# EAGLE design withcc3200 (EAGLE 6.5.0)

## Sheet 1 of 3
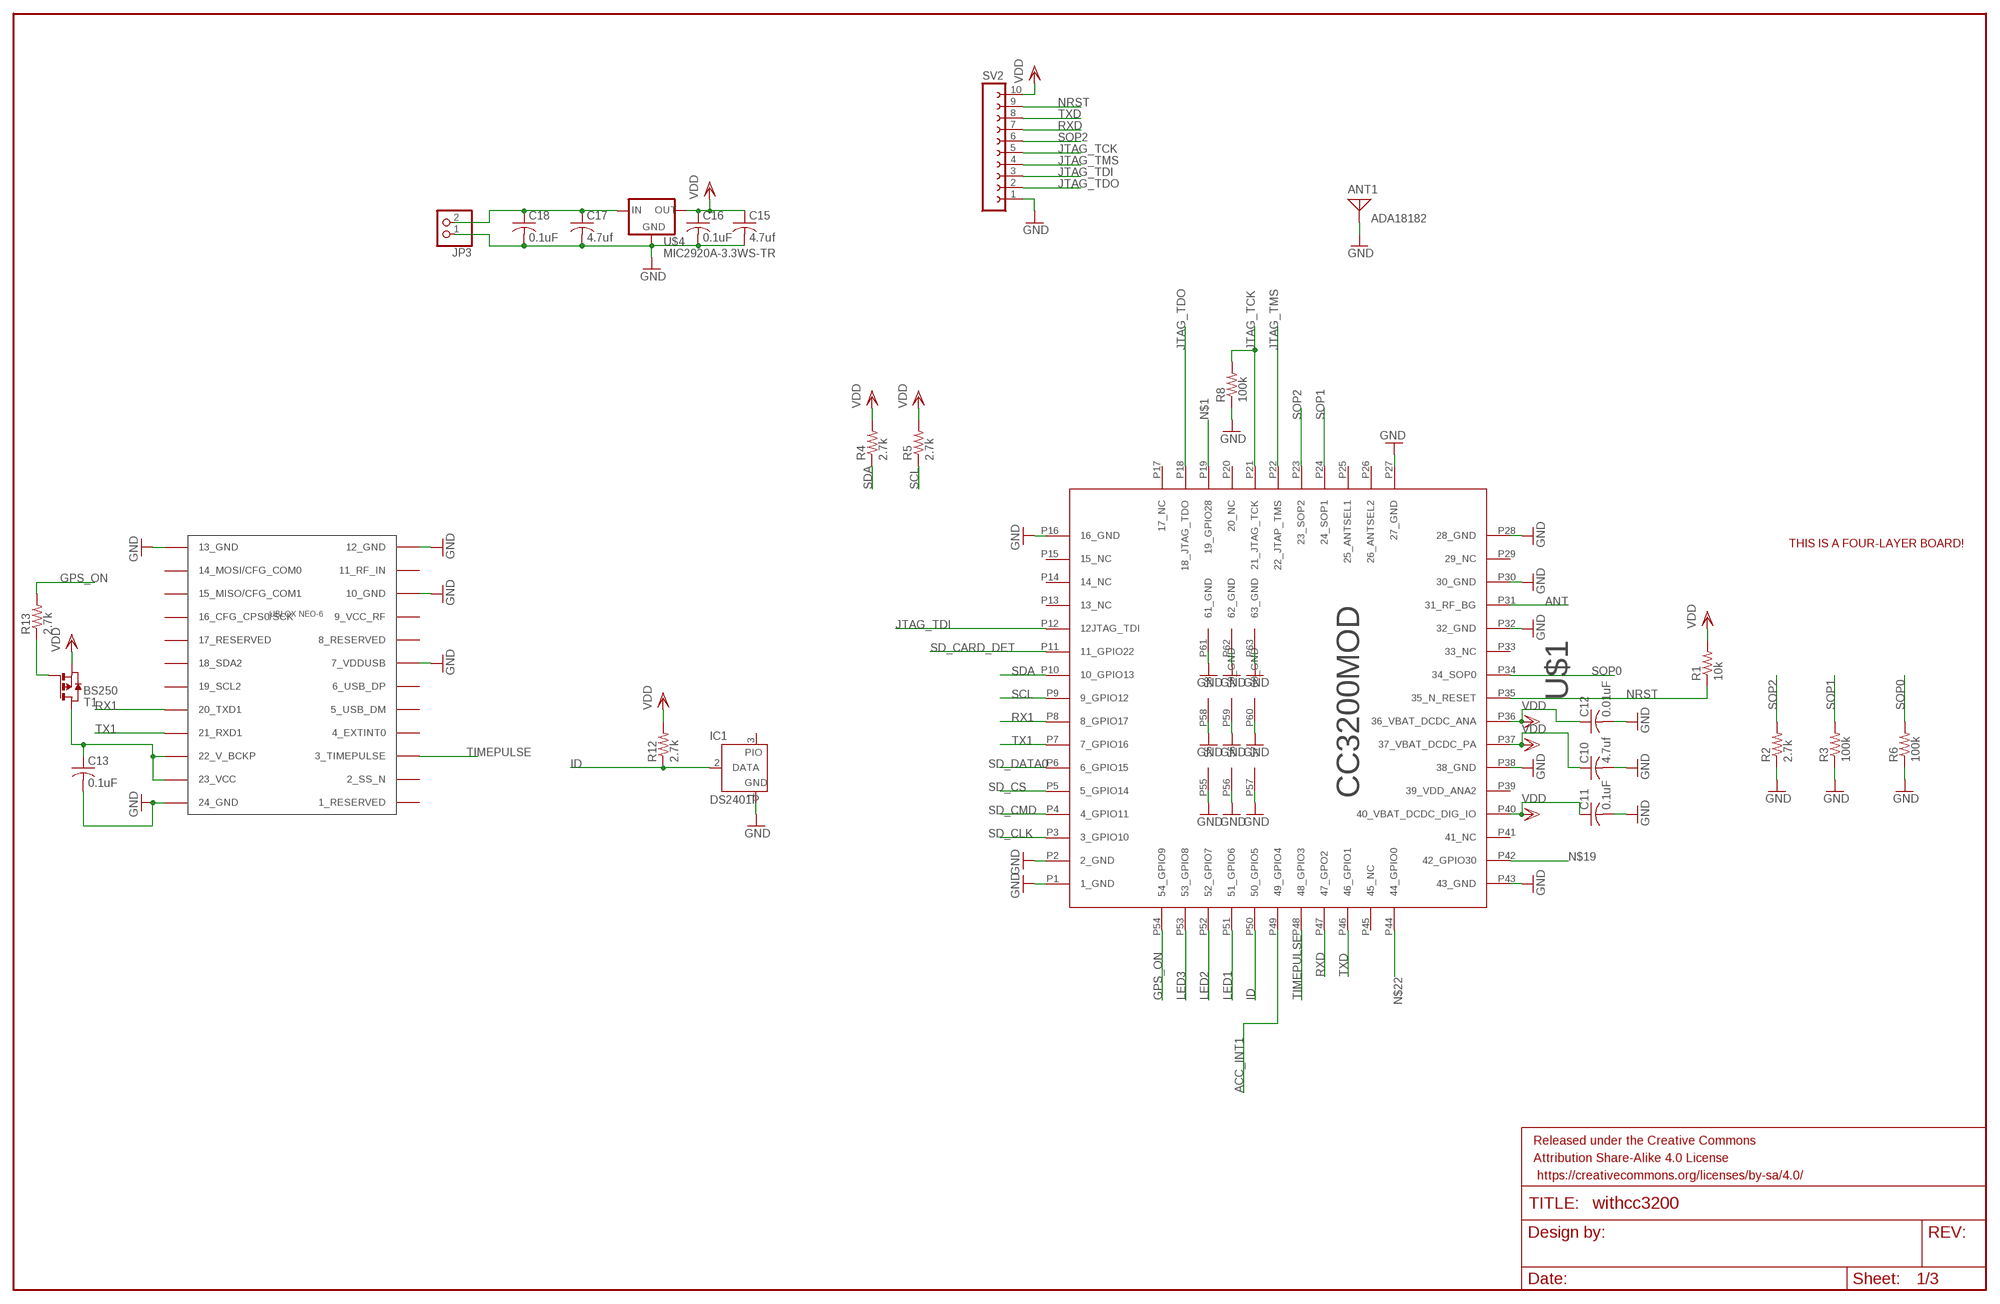
[diagram p0: schematic, sheet 1]

### Parts
ANT1  ADA18182  ANTENNA  [PAD-01]
C10  4.7uf  C-USC0805K  [C0805K]
C11  0.1uF  C-USC0805K  [C0805K]
C12  0.01uF  C-USC0805K  [C0805K]
C13  0.1uF  C-USC0805K  [C0805K]
C15  4.7uf  C-USC0805K  [C0805K]
C16  0.1uF  C-USC0805K  [C0805K]
C17  4.7uf  C-USC0805K  [C0805K]
C18  0.1uF  C-USC0805K  [C0805K]
FRAME1  FRAME-LEDGER  [CREATIVE_COMMONS]
IC1  DS2401P  DS2405P  [TSOC6]
JP3  PINHD-1X2  [1X02]
R1  10k  R-US_R0603  [R0603]
R2  2.7k  R-US_R0603  [R0603]
R3  100k  R-US_R0603  [R0603]
R4  2.7k  R-US_R0603  [R0603]
R5  2.7k  R-US_R0603  [R0603]
R6  100k  R-US_R0603  [R0603]
R8  100k  R-US_R0603  [R0603]
R12  2.7k  R-US_R0603  [R0603]
R13  2.7k  R-US_R0603  [R0603]
SV2  FE10-1  [FE10]
T1  BS250  PMOSSOT23  [SOT-23]
U$1  CC3200MOD  CC3200  [CC3200MOD]
U$2  UBLOX_NEO-7  UBLOX_NEO-6  [UBLOX_NEO-6P]
U$3  FOUR_LAYER_WARNING  [FOUR_LAYER_WARNING]
U$4  MIC2920A-3.3WS-TR  V_REG_MIC2920  [SOT223]

### Nets
ACC_INT1: U$1.P49(49_GPIO4) ; also sheet 2
ANT: U$1.P31(31_RF_BG)
GND: ANT1.1 C10.2 C11.2 C12.2 C13.2 C15.2 C16.2 C17.2 C18.2 IC1.1(GND) JP3.1 R2.1 R3.1 R6.1 R8.1 SV2.1 U$1.P1(1_GND) U$1.P2(2_GND) U$1.P16(16_GND) U$1.P27(27_GND) U$1.P28(28_GND) U$1.P30(30_GND) U$1.P32(32_GND) U$1.P38(38_GND) U$1.P43(43_GND) U$1.P55 U$1.P56 U$1.P57 U$1.P58 U$1.P59(59_GND) U$1.P60(60_GND) U$1.P61(61_GND) U$1.P62(62_GND) U$1.P63(63_GND) U$2.7_VDDUSB U$2.10_GND U$2.12_GND U$2.13_GND U$2.24_GND U$4.2(GND) ; also sheet 2,3
GPS_ON: R13.2 U$1.P54(54_GPIO9)
ID: IC1.2(DATA) R12.1 U$1.P50(50_GPIO5)
JTAG_TCK: R8.2 SV2.5 U$1.P21(21_JTAG_TCK)
JTAG_TDI: SV2.3 U$1.P12(12JTAG_TDI)
JTAG_TDO: SV2.2 U$1.P18(18_JTAG_TDO)
JTAG_TMS: SV2.4 U$1.P22(22_JTAP_TMS)
LED1: U$1.P51(51_GPIO6) ; also sheet 3
LED2: U$1.P52(52_GPIO7) ; also sheet 3
LED3: U$1.P53(53_GPIO8) ; also sheet 3
N$1: U$1.P19(19_GPIO28)
N$17: C17.1 C18.1 JP3.2 U$4.1(IN)
N$18: C13.1 T1.1(D) U$2.22_V_BCKP U$2.23_VCC
N$19: U$1.P42(42_GPIO30)
N$20: R13.1 T1.3(G)
N$22: U$1.P44(44_GPIO0)
NRST: R1.1 SV2.9 U$1.P35(35_N_RESET)
RX1: U$1.P8(8_GPIO17) U$2.20_TXD1
RXD: SV2.7 U$1.P47(47_GPO2)
SCL: R5.1 U$1.P9(9_GPIO12) ; also sheet 2
SD_CARD_DET: U$1.P11(11_GPIO22) ; also sheet 2
SD_CLK: U$1.P3(3_GPIO10) ; also sheet 2
SD_CMD: U$1.P4(4_GPIO11) ; also sheet 2
SD_CS: U$1.P5(5_GPIO14) ; also sheet 2
SD_DATA0: U$1.P6(6_GPIO15) ; also sheet 2
SDA: R4.1 U$1.P10(10_GPIO13) ; also sheet 2
SOP0: R6.2 U$1.P34(34_SOP0)
SOP1: R3.2 U$1.P24(24_SOP1)
SOP2: R2.2 SV2.6 U$1.P23(23_SOP2)
TIMEPULSE: U$1.P48(48_GPIO3) U$2.3_TIMEPULSE
TX1: U$1.P7(7_GPIO16) U$2.21_RXD1
TXD: SV2.8 U$1.P46(46_GPIO1)
VDD: C10.1 C11.1 C12.1 C15.1 C16.1 R1.2 R4.2 R5.2 R12.2 SV2.10 T1.2(S) U$1.P36(36_VBAT_DCDC_ANA) U$1.P37(37_VBAT_DCDC_PA) U$1.P40(40_VBAT_DCDC_DIG_IO) U$4.3(OUT) ; also sheet 2
Unconnected: IC1.3(PIO) U$1.P13(13_NC) U$1.P14(14_NC) U$1.P15(15_NC) U$1.P17(17_NC) U$1.P20(20_NC) U$1.P25(25_ANTSEL1) U$1.P26(26_ANTSEL2) U$1.P29(29_NC) U$1.P33(33_NC) U$1.P39(39_VDD_ANA2) U$1.P41(41_NC) U$1.P45(45_NC) U$2.1_RESERVED U$2.2_SS_N U$2.4_EXTINT0 U$2.5_USB_DM U$2.6_USB_DP U$2.8_RESERVED U$2.9_VCC_RF U$2.11_RF_IN U$2.14_MOSI/CFG_COM0 U$2.15_MISO/CFG_COM1 U$2.16_CFG_CPS0/SCK U$2.17_RESERVED U$2.18_SDA2 U$2.19_SCL2

## Sheet 2 of 3
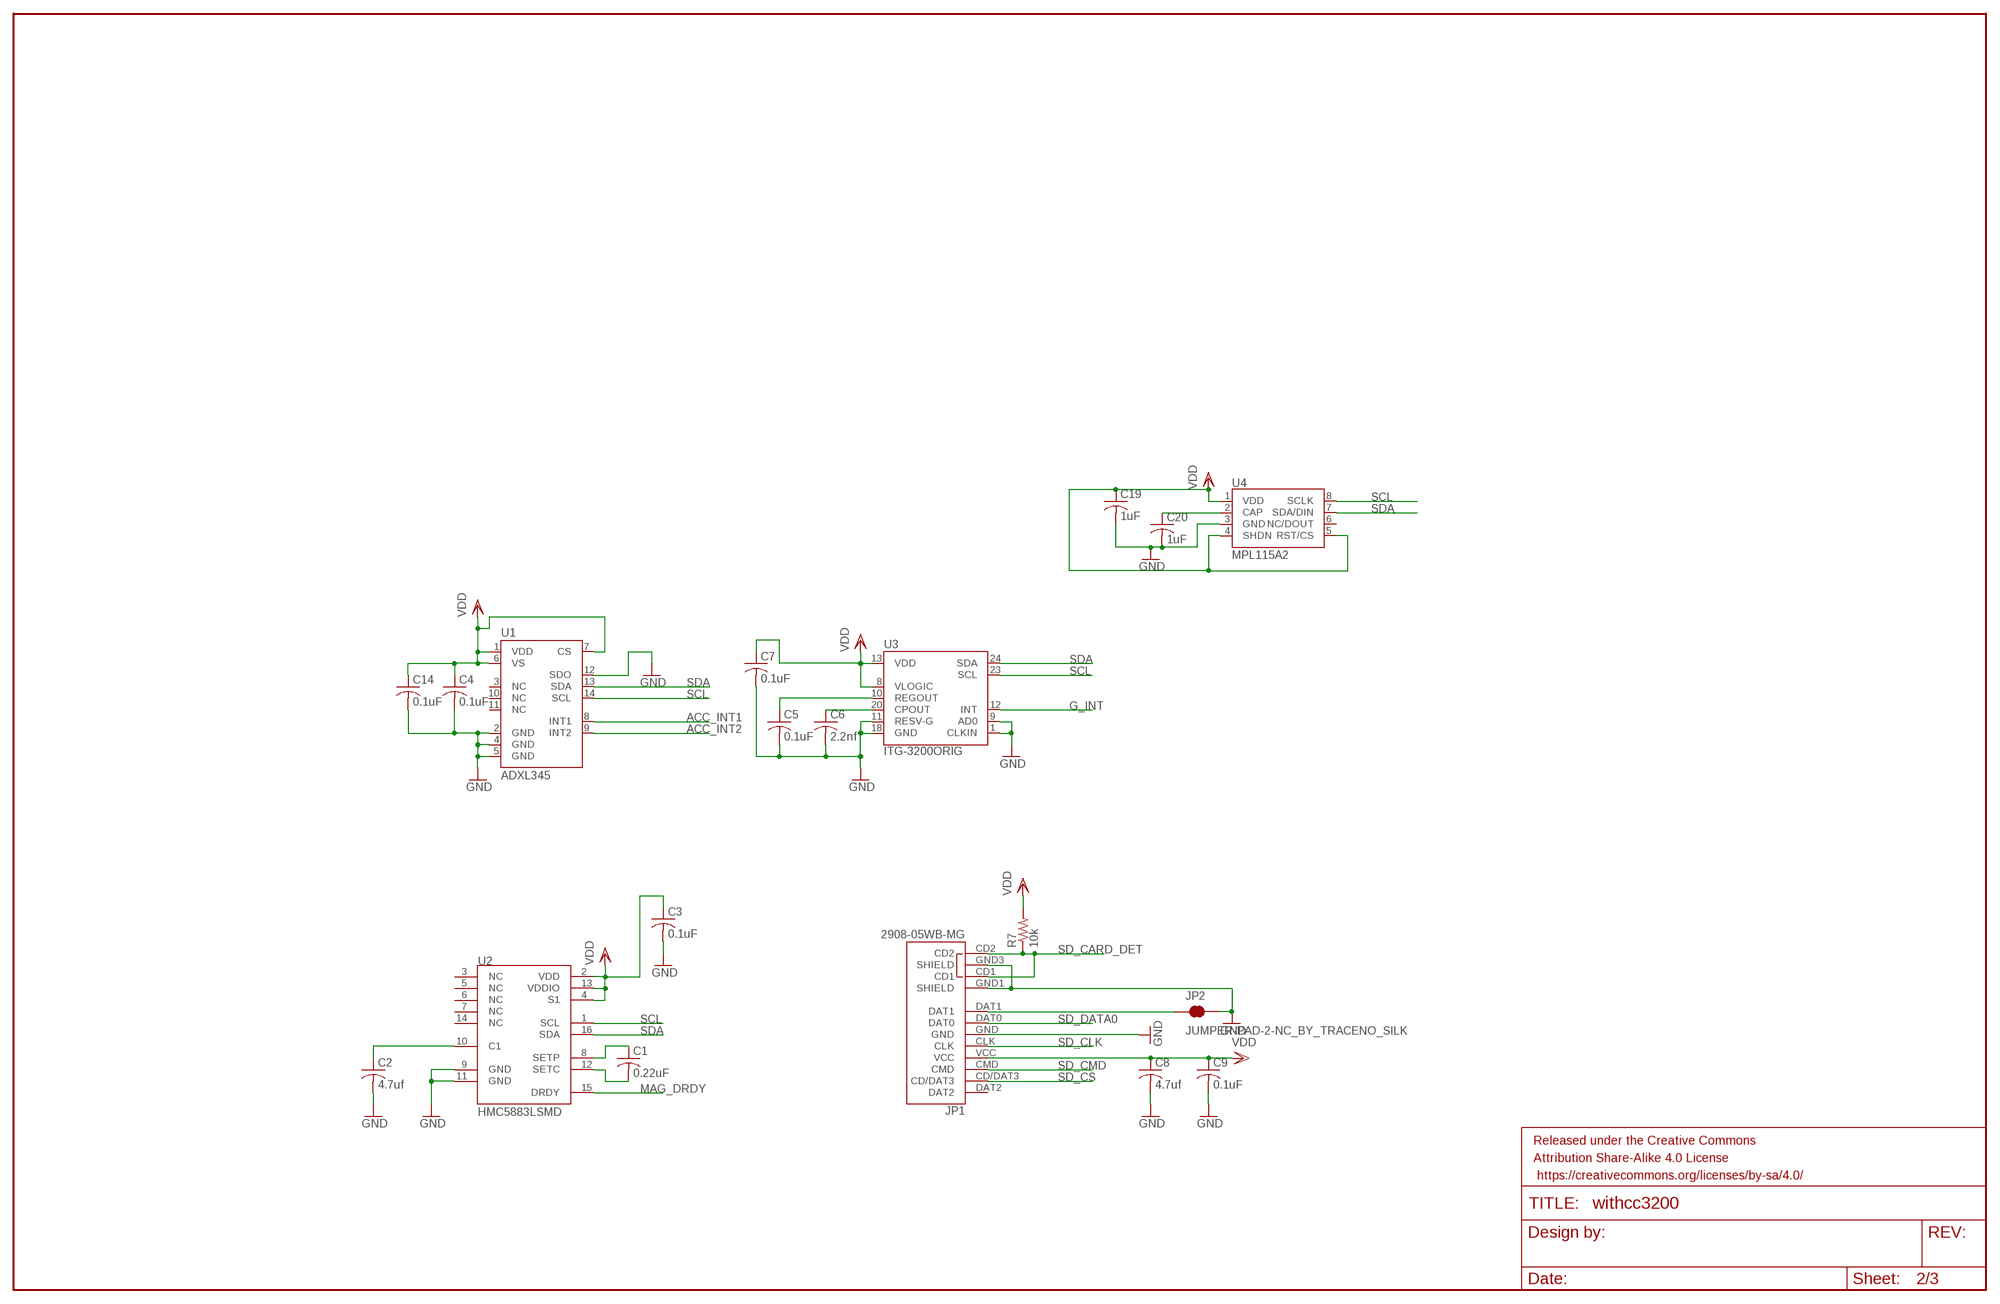
[diagram p1: schematic, sheet 2]

### Parts
C1  0.22uF  C-USC0805K  [C0805K]
C2  4.7uf  C-USC0805K  [C0805K]
C3  0.1uF  C-USC0805K  [C0805K]
C4  0.1uF  C-USC0805K  [C0805K]
C5  0.1uF  C-USC0805K  [C0805K]
C6  2.2nf  C-USC0805K  [C0805K]
C7  0.1uF  C-USC0805K  [C0805K]
C8  4.7uf  C-USC0805K  [C0805K]
C9  0.1uF  C-USC0805K  [C0805K]
C14  0.1uF  C-USC0805K  [C0805K]
C19  1uF  C-USC0805K  [C0805K]
C20  1uF  C-USC0805K  [C0805K]
FRAME2  FRAME-LEDGER  [CREATIVE_COMMONS]
JP1  2908-05WB-MG  USD-SDIO-SOCKET  [MICRO-SD-SOCKET-SDIO]
JP2  JUMPER-PAD-2-NC_BY_TRACENO_SILK  [PAD-JUMPER-2-NC_BY_TRACE_NO_SILK]
R7  10k  R-US_R0603  [R0603]
U1  ADXL345  [LGA14]
U2  HMC5883LSMD  [16LPCC]
U3  ITG-3200ORIG  [QFN-24]
U4  MPL115A2  MPL115A  [LGA8]

### Nets
ACC_INT1: U1.8(INT1) ; also sheet 1
ACC_INT2: U1.9(INT2)
G_INT: U3.12(INT)
GND: C2.2 C3.2 C4.2 C5.2 C6.2 C7.2 C8.2 C9.2 C14.2 C19.2 C20.2 JP1.GND JP1.GND1(SHIELD) JP1.GND3(SHIELD) JP2.2 U1.2(GND) U1.4(GND) U1.5(GND) U1.12(SDO) U2.9(GND) U2.11(GND) U3.1(CLKIN) U3.9(AD0) U3.11(RESV-G) U3.18(GND) U4.3(GND) ; also sheet 1,3
MAG_DRDY: U2.15(DRDY)
N$7: JP1.DAT1 JP2.1
N$8: C1.2 U2.12(SETC)
N$9: C1.1 U2.8(SETP)
N$10: C2.1 U2.10(C1)
N$13: C5.1 U3.10(REGOUT)
N$15: C6.1 U3.20(CPOUT)
N$23: C20.1 U4.2(CAP)
SCL: U1.14(SCL) U2.1(SCL) U3.23(SCL) U4.8(SCLK) ; also sheet 1
SD_CARD_DET: JP1.CD1 JP1.CD2 R7.1 ; also sheet 1
SD_CLK: JP1.CLK ; also sheet 1
SD_CMD: JP1.CMD ; also sheet 1
SD_CS: JP1.CD/DAT3 ; also sheet 1
SD_DATA0: JP1.DAT0 ; also sheet 1
SDA: U1.13(SDA) U2.16(SDA) U3.24(SDA) U4.7(SDA/DIN) ; also sheet 1
VDD: C3.1 C4.1 C7.1 C8.1 C9.1 C14.1 C19.1 JP1.VCC R7.2 U1.1(VDD) U1.6(VS) U1.7(CS) U2.2(VDD) U2.4(S1) U2.13(VDDIO) U3.8(VLOGIC) U3.13(VDD) U4.1(VDD) U4.4(SHDN) U4.5(RST/CS) ; also sheet 1
Unconnected: JP1.DAT2 U1.3(NC) U1.10(NC) U1.11(NC) U2.3(NC) U2.5(NC) U2.6(NC) U2.7(NC) U2.14(NC) U4.6(NC/DOUT)

## Sheet 3 of 3
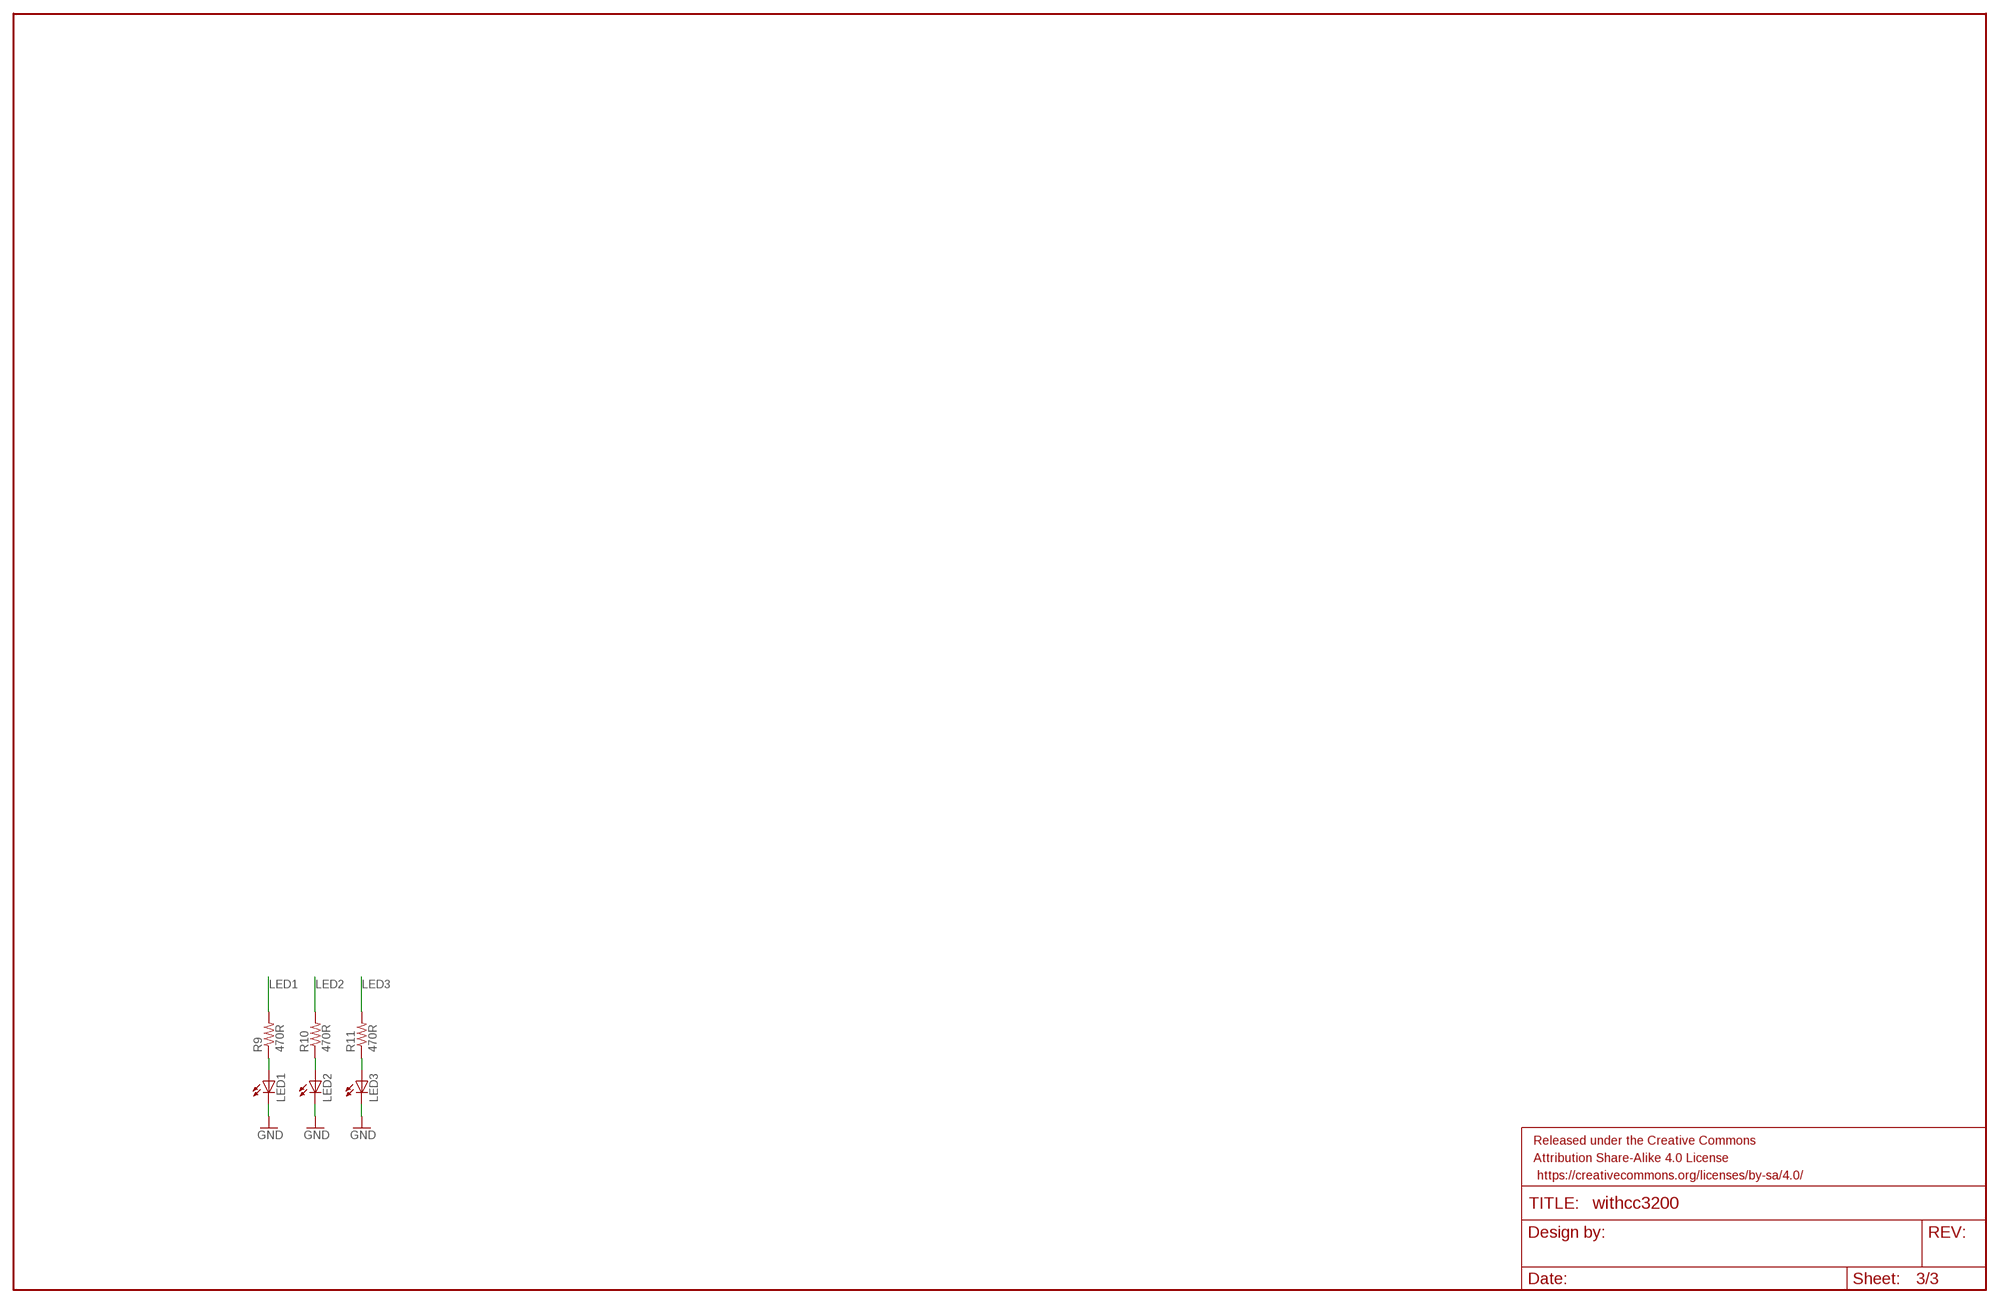
[diagram p2: schematic, sheet 3]

### Parts
FRAME3  FRAME-LEDGER  [CREATIVE_COMMONS]
LED1  LEDCHIPLED_0805  [CHIPLED_0805]
LED2  LEDCHIPLED_0805  [CHIPLED_0805]
LED3  LEDCHIPLED_0805  [CHIPLED_0805]
R9  470R  R-US_R0603  [R0603]
R10  470R  R-US_R0603  [R0603]
R11  470R  R-US_R0603  [R0603]

### Nets
GND: LED1.C LED2.C LED3.C ; also sheet 1,2
LED1: R9.2 ; also sheet 1
LED2: R10.2 ; also sheet 1
LED3: R11.2 ; also sheet 1
N$11: LED1.A R9.1
N$12: LED2.A R10.1
N$14: LED3.A R11.1

## Library data of the parts
ANT1 = discrete:ANTENNA: Antenna
C1-C20 = rcl:C-US: CAPACITOR, American symbol
FRAME1-FRAME3 = SparkFun-Aesthetics:FRAME-LEDGER: Schematic Frame Standard 11x14 US Ledger frame
IC1 = maxim:DS2405: Addressable Switch DALLAS Semiconductor; OC_FARNELL: unknown; OC_NEWARK: unknown
JP1 = SparkFun-Connectors:USD-SDIO-SOCKET: microSD Socket Push-push type uSD socket with full SDIO signal mapping. Spark Fun Electronics SKU : PRT-00127. tDoc lines correctly indicate media card edge positions when inserting (unlocked, locked, depressed). NOTE: CD1 and CD2 are connected internally, and short to ground when card is removed.; PROD_ID: CONN-07820
JP2 = SparkFun-Passives:JUMPER-PAD-2-NC_BY_TRACE
JP3 = pinhead:PINHD-1X2: PIN HEADER
LED1-LED3 = led:LED: LED OSRAM: - CHIPLED LG R971, LG N971, LY N971, LG Q971, LY Q971, LO R971, LY R971 LH N974, LH R974 LS Q976, LO Q976, LY Q976 LO Q996 - Hyper CHIPLED LW Q18S LB Q993, LB Q99A, LB R99A - SideLED LS A670, LO A670, LY A670, LG A670, LP A670 LB A673, LV A673, LT A673, LW A673 LH A674 LY A675 LS A676, LA A676, LO A676, LY A676, LW A676 LS A679, LY A679, LG A679 - Hyper Micro SIDELED® LS Y876, LA Y876, LO Y876, LY Y876 LT Y87S - SmartLED LW L88C, LW L88S LB L89C, LB L89S, LG L890 LS L89K, LO L89K, LY L89K LS L896, LA L896, LO L896, LY L896 - TOPLED LS T670, LO T670, LY T670, LG T670, LP T670 LSG T670, LSP T670, LSY T670, LOP T670, LYG T670 LG T671, LOG T671, LSG T671 LB T673, LV T673, LT T673, LW T673 LH T674 LS T676, LA T676, LO T676, LY T676, LB T676, LH T676, LSB T676, LW T676 LB T67C, LV T67C, LT T67C, LS T67K, LO T67K, LY T67K, LW E67C LS E67B, LA E67B, LO E67B, LY E67B, LB E67C, LV E67C, LT E67C LW T67C LS T679, LY T679, LG T679 LS T770, LO T770, LY T770, LG T770, LP T770 LB T773, LV T773, LT T773, LW T773 LH T774 LS E675, LA E675, LY E675, LS T675 LS T776, LA T776, LO T776, LY T776, LB T776 LHGB T686 LT T68C, LB T68C - Hyper Mini TOPLED® LB M676 - Mini TOPLED Santana® LG M470 LS M47K, LO M47K, LY M47K Source: http://www.osram.convergy.de LUXEON: - LUMILED® LXK2-PW12-R00, LXK2-PW12-S00, LXK2-PW14-U00, LXK2-PW14-V00 LXK2-PM12-R00, LXK2-PM12-S00, LXK2-PM14-U00 LXK2-PE12-Q00, LXK2-PE12-R00, LXK2-PE12-S00, LXK2-PE14-T00, LXK2-PE14-U00 LXK2-PB12-K00, LXK2-PB12-L00, LXK2-PB12-M00, LXK2-PB14-N00, LXK2-PB14-P00, LXK2-PB14-Q00 LXK2-PR12-L00, LXK2-PR12-M00, LXK2-PR14-Q00, LXK2-PR14-R00 LXK2-PD12-Q00, LXK2-PD12-R00, LXK2-PD12-S00 LXK2-PH12-R00, LXK2-PH12-S00 LXK2-PL12-P00, LXK2-PL12-Q00, LXK2-PL12-R00 Source: www.luxeon.com KINGBRIGHT: KA-3528ASYC Source: www.kingbright.com
R1-R13 = rcl:R-US_: RESISTOR, American symbol
SV2 = con-lsta:FE10-1: FEMALE HEADER; OC_FARNELL: unknown; OC_NEWARK: unknown
T1 = zetex:PMOSSOT23: MOS FET; OC_FARNELL: unknown; OC_NEWARK: unknown
U1 = SparkFun-Sensors:ADXL345: 3-axis SPI/I2C 2/4/8/16g accelerometer
U2 = SparkFun-Sensors:HMC5883L: 3 Axis Digital Compass IC; PROD_ID: IC-10284
U3 = SparkFun-DigitalIC:ITG-3200: ITG-3200 3-axis gyro, digital output, qfn24 package
U4 = SparkFun-Sensors:MPL115A: MPL115A1 (SPI) and MPL115A2 (I2C) Miniature Digital Barometer 5.0x3.0x1.2mm LGA Package
U$1 = cc3200mod:CC3200
U$2 = Ava:UBLOX_NEO-6: UBLOX NEO-6 GPS MODULE Author Anthony Stirk / http://ava.upuaut.net http://www.u-blox.com/images/downloads/Product_Docs/LEA-6_NEO-6_MAX_HardwareIntegrationManual_%28GPS.G6-HW-09007%29.pdf http://www.u-blox.com/images/downloads/Product_Docs/NEO-6_DataSheet_%28GPS.G6-HW-09005%29.pdf
U$3 = SparkFun-Aesthetics:FOUR_LAYER_WARNING: Warning text which will appear on both the schematic and the board file, notifying viewers that the design is a four-layer PCB.
U$4 = SparkFun-PowerIC:V_REG_MIC2920: MIC2920A (http://www.micrel.com/_PDF/mic2920.pdf) - 400mA output LDO Regulator

## Board
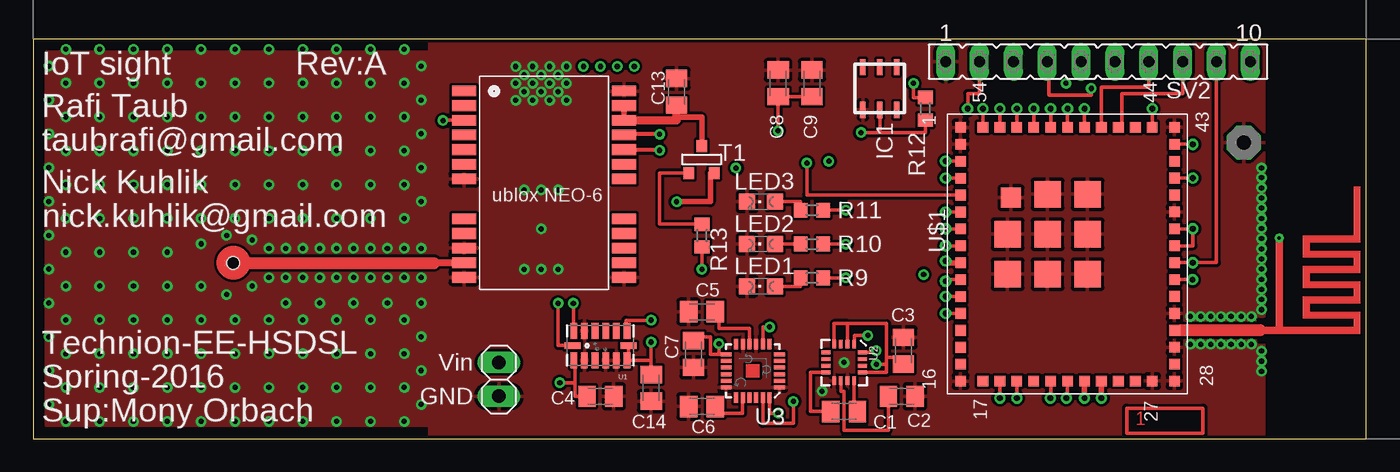
[diagram p3: board, top side]
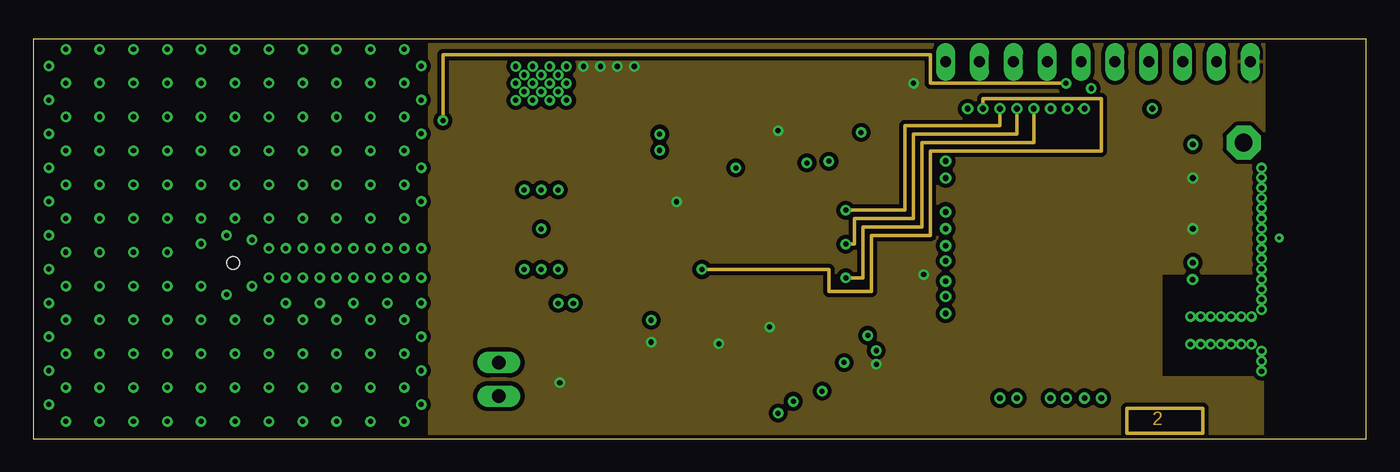
[diagram p4: board, inner layer Route2]
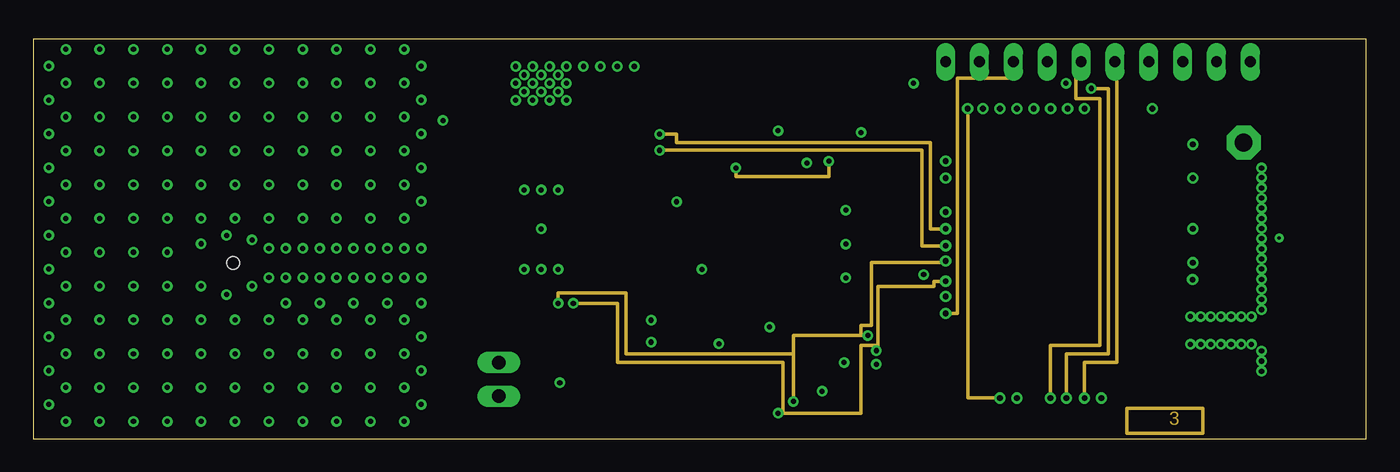
[diagram p5: board, inner layer Route3]
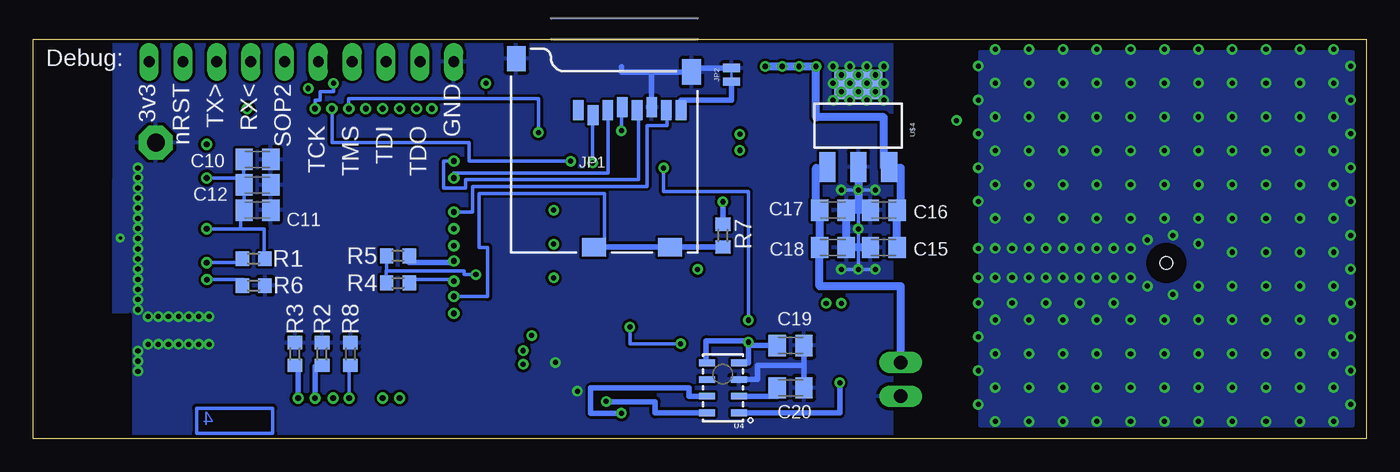
[diagram p6: board, bottom side, seen from below]

Size 100 x 30 mm. Coordinates in mm from the lower left corner, seen from the top.
Outline: 0,0 100,0 100,30 0,30 0,0
Copper layers (1*2*3*16): Top 0.035mm / dielectric 1.5mm / Route2 0.035mm / dielectric 0.15mm / Route3 0.035mm / dielectric 0.2mm / Bottom 0.035mm
Design rules "SparkFun *": minimum track width 1mil, minimum drill 10mil, track to track 8mil, track to pad 8mil, pad to pad 8mil, via to via 8mil, smd to smd 8mil, copper to edge 10mil, drill to drill 8mil, minimum pad ring 12mil, minimum via ring 8mil, stop-mask expansion 4mil, vias tented up to drill 16mil, thermal gap 10mil
Holes 0.95 mm at 15,13.2
tRestrict: area 92.8,4.9 to 100.1,20.6; 2 lines
bRestrict: area 92.8,0.2 to 97,29.8; area 13.5,11.7 to 16.5,14.7

### Footprints (pad centres in the part's own frame; a part is rotated, then mirrored left to right if it is on the bottom)
PAD-01 = drill 1.321 pad 2.54 octagon: 1 0,0
C0805K = smd 1.3 x 1.6: 1 -1,0; 2 1,0
TSOC6 = smd 0.406 x 1.219: 1 -1.27,-1.6; 2 0,-1.6; 3 1.27,-1.6; 4 1.27,1.6; 5 0,1.6; 6 -1.27,1.6
MICRO-SD-SOCKET-SDIO = smd 1.8 x 1.4: CD1 11.92,0.4; CD2 6.22,0.4 | smd 0.8 x 1.5: CD/DAT3 6.13,10.3; CLK 9.43,10.7; CMD 7.23,10.7; DAT0 11.63,10.7; DAT1 12.73,10.7; DAT2 5.03,10.7; GND 10.53,10.9; VCC 8.33,10.9 | smd 1.4 x 1.9: GND1 0.37,14.55; GND3 13.52,13.55
PAD-JUMPER-2-NC_BY_TRACE_NO_SILK = smd 0.635 x 1.27: 1 -0.508,0; 2 0.508,0
1X02 = drill 1.016 long: 1 -1.27,0; 2 1.27,0
CHIPLED_0805 = smd 1.2 x 1.2: A 0,-1.05; C 0,1.05
R0603 = smd 1 x 1.1: 1 -0.85,0; 2 0.85,0
FE10 = drill 0.813 long: 1 -11.43,0; 2 -8.89,0; 3 -6.35,0; 4 -3.81,0; 5 -1.27,0; 6 1.27,0; 7 3.81,0; 8 6.35,0; 9 8.89,0; 10 11.43,0
SOT-23 = smd 0.787 x 0.889: 1 0.025,-1.016; 2 -0.94,1.016; 3 0.991,1.016
LGA14 = smd 0.5 x 1.2: 1 2,1.1; 2 1.2,1.1; 3 0.4,1.1; 4 -0.4,1.1; 5 -1.2,1.1; 6 -2,1.1; 8 -2,-1.1; 9 -1.2,-1.1; 10 -0.4,-1.1; 11 0.4,-1.1; 12 1.2,-1.1; 13 2,-1.1 | smd 1.2 x 0.5: 7 -2.1,0; 14 2.1,0
16LPCC = smd 0.65 x 0.28: 1 -1.37,0.75; 2 -1.37,0.25; 3 -1.37,-0.25; 4 -1.37,-0.75; 9 1.37,-0.75; 10 1.37,-0.25; 11 1.37,0.25; 12 1.37,0.75 | smd 0.28 x 0.65: 5 -0.75,-1.37; 6 -0.25,-1.37; 7 0.25,-1.37; 8 0.75,-1.37; 13 0.75,1.37; 14 0.25,1.37; 15 -0.25,1.37; 16 -0.75,1.37
QFN-24 = smd 0.8 x 0.3: 1 -2,1.25; 2 -2,0.75; 3 -2,0.25; 4 -2,-0.25; 5 -2,-0.75; 6 -2,-1.25; 13 2,-1.25; 14 2,-0.75; 15 2,-0.25; 16 2,0.25; 17 2,0.75; 18 2,1.25 | smd 0.3 x 0.8: 7 -1.25,-2; 8 -0.75,-2; 9 -0.25,-2; 10 0.25,-2; 11 0.75,-2; 12 1.25,-2; 19 1.25,2; 20 0.75,2; 21 0.25,2; 22 -0.25,2; 23 -0.75,2; 24 -1.25,2
LGA8 = smd 1.2 x 0.5: 1 -1.2,1.875; 2 -1.2,0.625; 3 -1.2,-0.625; 4 -1.2,-1.875; 5 1.2,-1.875; 6 1.2,-0.625; 7 1.2,0.625; 8 1.2,1.875
CC3200MOD = smd 0.8 x 0.8: P1 9.52,8.025; P2 8.25,8.025; P3 6.98,8.025; P4 5.71,8.025; P5 4.44,8.025; P6 3.17,8.025; P7 1.9,8.025; P8 0.63,8.025; P9 -0.64,8.025; P10 -1.91,8.025; P11 -3.18,8.025; P12 -4.45,8.025; P13 -5.72,8.025; P14 -6.99,8.025; P15 -8.26,8.025; P16 -9.53,8.025; P17 -9.525,6.35; P18 -9.525,5.08; P19 -9.525,3.81; P20 -9.525,2.54; P21 -9.525,1.27; P22 -9.525,0; P23 -9.525,-1.27; P24 -9.525,-2.54; P25 -9.525,-3.81; P26 -9.525,-5.08; P27 -9.525,-6.35; P28 -9.525,-8.02; P29 -8.255,-8.02; P30 -6.985,-8.02; P31 -5.715,-8.02; P32 -4.445,-8.02; P33 -3.175,-8.02; P34 -1.905,-8.02; P35 -0.635,-8.02; P36 0.635,-8.02; P37 1.905,-8.02; P38 3.175,-8.02; P39 4.445,-8.02; P40 5.715,-8.02; P41 6.985,-8.02; P42 8.255,-8.02; P43 9.525,-8.02; P44 9.525,-6.35; P45 9.525,-5.08; P46 9.525,-3.81; P47 9.525,-2.54; P48 9.525,-1.27; P49 9.525,0; P50 9.525,1.27; P51 9.525,2.54; P52 9.525,3.81; P53 9.525,5.08; P54 9.525,6.35 | smd 1.5 x 1.5: P55 4.25,4.25 | smd 2 x 2: P56 1.5,-1.5; P57 -1.5,4.5; P58 4.5,1.5; P59 1.5,1.5; P60 -1.5,1.5; P61 4.5,-1.5; P62 1.5,4.5; P63 -1.5,-1.5
UBLOX_NEO-6P = smd 1.8 x 0.8: 1_RESERVED 6.4,-7.4; 2_SS_N 6.4,-6.3; 3_TIMEPULSE 6.4,-5.2; 4_EXTINT0 6.4,-4.1; 5_USB_DM 6.4,-3; 6_USB_DP 6.4,-1.9; 7_VDDUSB 6.4,-0.8; 8_RESERVED 6.4,2.2; 9_VCC_RF 6.4,3.3; 10_GND 6.4,4.4; 11_RF_IN 6.4,5.5; 12_GND 6.4,6.6; 13_GND -5.6,6.6; 14_MOSI/CFG_COM0 -5.6,5.5; 15_MISO/CFG_COM1 -5.6,4.4; 16_CFG_CPS0/SCK -5.6,3.3; 17_RESERVED -5.6,2.2; 18_SDA2 -5.6,-0.8; 19_SCL2 -5.6,-1.9; 20_TXD1 -5.6,-3; 21_RXD1 -5.6,-4.1; 22_V_BCKP -5.6,-5.2; 23_VCC -5.6,-6.3; 24_GND -5.6,-7.4
SOT223 = smd 1.219 x 2.235: 1 -2.311,-3.099; 2 0,-3.099; 3 2.311,-3.099 | smd 3.6 x 2.2: 4 0,3.099

### Placement (x,y rotation side)
ANT1  90.81,22.23 0 top
C1  60.83,2.03 0 top
C2  65.15,3.17 0 top
C3  65.28,6.6 90 top
C4  42.55,3.17 0 top
C5  50.16,9.53 180 top
C6  50.16,2.41 180 top
C7  49.53,6.35 270 top
C8  55.88,26.67 90 top
C9  58.42,26.67 90 top
C10  83.19,20.95 0 bottom
C11  83.19,17.14 0 bottom
C12  83.19,19.05 0 bottom
C13  48.26,26.04 90 top
C14  46.35,3.81 270 top
C15  36.2,14.35 180 bottom
C16  36.2,17.14 180 bottom
C17  40.01,17.14 0 bottom
C18  40.01,14.35 0 bottom
C19  43.18,6.99 0 bottom
C20  43.18,3.81 0 bottom
FRAME1  20.32,40.01 0 top  (outside the outline)
FRAME2  20.32,40.01 0 top  (outside the outline)
FRAME3  20.32,40.01 0 top  (outside the outline)
IC1  63.5,26.29 0 top
JP1  64.14,13.97 0 bottom
JP2  47.62,27.3 90 bottom
JP3  34.92,4.45 90 top
LED1  54.61,11.43 90 top
LED2  54.61,14.61 90 top
LED3  54.61,17.78 90 top
R1  83.46,13.51 0 bottom
R2  78.33,6.35 270 bottom
R3  80.37,6.35 270 bottom
R4  72.64,11.68 180 bottom
R5  72.64,13.72 180 bottom
R6  83.46,11.48 180 bottom
R7  48.26,15.24 90 bottom
R8  76.2,6.35 270 bottom
R9  58.42,12.06 0 top
R10  58.42,14.61 0 top
R11  58.42,17.14 0 top
R12  66.93,24.77 90 top
R13  50.16,15.24 270 top
SV2  79.88,28.3 0 top
T1  50.16,20.95 180 top
U1  42.55,6.99 180 top
U2  60.83,5.71 270 top
U3  53.98,5.08 180 top
U4  48.26,3.81 180 bottom
U$1  77.6,13.84 90 top
U$2  38.71,18.7 180 top
U$3  0.64,-3.81 0 top  (outside the outline)
U$4  38.1,23.5 0 bottom

### Tracks (layer width: path | path; a pad name or v marks a point on that pad's centre or on a via)
ACC_INT1  (via drill 0.38, 0.43)
  Top 0.254: U1.8 44.45,8.09 44.45,8.89 v46.35,8.89 | U$1.P49 v77.6,24.77
  Route3 0.254: v52.7,20.32 52.7,19.68 59.69,19.68 v59.69,20.83
  Bottom 0.254: v46.35,8.89 46.35,18.54 52.7,18.54 v52.7,20.32 | v59.69,20.83 67.31,20.83 67.31,22.23 77.6,22.23 77.6,24.64 v77.6,24.77
ANT
  Top 0.305: 86.69,8.1 85.62,8.1 U$1.P31
GND  (via drill 0.25 pad 0.25, 0.38)
  Bottom 0.254: v36.83,18.67 v38.1,18.67 v39.37,18.67 | 38.1,17.14 v38.1,15.75 v38.1,12.7 v36.83,12.7 v39.37,12.7
  Bottom 0.406: JP1.GND3 53.6,27.52 JP1.GND | JP1.GND3 55.88,27.52 55.88,27.94 | JP2.2 50.62,27.81 JP1.GND3 | C20.2 42.18,5.48 | 42.18,5.48 C19.2 | U4.3 45.69,4.43 45.69,5.48 42.18,5.48
  Bottom 0.61: C15.2 C18.2 C17.2 38.1,17.14 | C16.2 38.1,17.14 | U$4.2 v38.1,18.67 38.1,17.14
  other vias: 92.15,9.68 92.15,10.44 92.15,11.2 92.15,11.96 92.15,12.73 92.15,13.49 92.15,14.25 92.15,15.01 92.15,15.77 92.15,16.54 92.15,17.3 92.15,18.06 92.15,18.82 92.15,19.58 92.15,20.32 92.15,6.58 92.15,5.82 92.15,5.05 93.47,15.06 91.39,9.17 90.63,9.17 89.87,9.17 89.1,9.17 88.34,9.17 87.58,9.17 86.82,9.17 91.39,7.09 90.63,7.09 89.87,7.09 89.1,7.09 88.34,7.09 87.58,7.09 86.82,7.09 18.94,12.09 20.21,12.09 21.48,12.09 22.75,12.09 24.02,12.09 25.29,12.09 26.56,12.09 27.83,12.09 27.83,14.29 26.56,14.29 25.29,14.29 24.02,14.29 22.75,14.29 21.48,14.29 20.21,14.29 18.94,14.29 17.67,8.91 17.67,6.37 17.67,3.83 17.67,1.29 15.13,1.29 27.83,8.91 25.29,8.91 22.75,8.91 20.21,8.91 20.21,6.37 22.75,6.37 25.29,6.37 27.83,6.37 27.83,3.83 25.29,3.83 22.75,3.83 20.21,3.83 20.21,1.29 22.75,1.29 25.29,1.29 27.83,1.29 15.13,3.83 15.13,6.37 15.13,8.91 12.59,8.91 12.59,6.37 12.59,3.83 12.59,1.29 10.05,3.83 7.51,6.37 7.51,3.83 4.97,3.83 2.43,3.83 2.43,1.29 4.97,1.29 7.51,1.29 10.05,1.29 10.05,6.37 10.05,8.91 7.51,8.91 4.97,6.37 2.43,6.37 2.43,8.91 4.97,8.91 10.05,11.45 10.05,13.99 10.05,16.53 10.05,19.07 12.59,19.07 12.59,16.53 17.67,16.53 20.21,16.53 22.75,16.53 25.29,16.53 27.83,16.53 27.83,19.07 25.29,19.07 22.75,21.61 22.75,19.07 20.21,19.07 17.67,19.07 15.13,19.07 7.51,11.45 4.97,11.45 2.43,11.45 4.97,13.99 2.43,13.99 2.43,16.53 4.97,16.53 7.51,16.53 7.51,13.99 7.51,19.07 4.97,19.07 2.43,21.61 2.43,19.07 4.97,21.61 7.51,21.61 10.05,21.61 12.59,21.61 15.13,21.61 17.67,21.61 20.21,21.61 25.29,21.61 27.83,21.61 27.83,24.15 25.29,24.15 22.75,24.15 20.21,24.15 17.67,24.15 15.13,24.15 12.59,24.15 10.05,24.15 4.97,24.15 7.51,24.15 2.43,24.15 2.43,26.69 4.97,26.69 7.51,26.69 10.05,26.69 12.59,26.69 15.13,26.69 17.67,26.69 20.21,26.69 22.75,26.69 25.29,26.69 27.83,26.69 1.16,25.42 1.16,22.88 1.16,20.34 1.16,17.8 1.16,15.26 1.16,12.72 1.16,10.18 1.16,7.64 1.16,5.1 1.16,2.56 29.1,25.42 29.1,22.88 29.1,20.34 29.1,17.8 29.1,10.18 29.1,7.64 29.1,5.1 29.1,2.56 27.83,29.23 25.29,29.23 22.75,29.23 7.51,29.23 10.05,29.23 12.59,29.23 15.13,29.23 17.67,29.23 20.21,29.23 29.1,27.96 29.1,14.29 29.1,12.09 2.43,29.23 4.97,29.23 1.16,27.96 24.02,10.18 26.56,10.18 21.48,10.18 18.94,10.18 60.83,5.71 59.18,3.56 36.2,27.94 37.47,27.94 38.73,27.94 40.01,27.94 39.37,27.3 38.1,27.3 36.83,27.3 36.2,26.67 37.47,26.67 36.83,26.04 36.2,25.4 37.47,25.4 38.1,26.04 38.73,25.4 39.37,26.04 40.01,26.67 38.73,26.67 40.01,25.4 17.67,14.29 17.67,12.09 16.4,11.45 16.4,14.92 12.59,11.45 15.13,16.53 14.5,10.82 14.5,15.26 12.59,14.63
  pour Top (isolate 0.152): 29.72,29.69 92.33,29.69 92.33,0.25 29.72,0.25
  pour Bottom (isolate 0.152): 96.7,29.69 35.66,29.69 35.66,0.25 96.7,0.25
  pour Bottom (isolate 0.5): 1,29 29,29 29,1 1,1
  pour Top (isolate 0.152): 1,29 30.27,29 30.27,1 1,1
  pour Bottom: 1,29 29,29 29,1 1,1
GPS_ANT
  Top 0.889: 14.94,13.18 30.05,13.18
GPS_ON  (via drill 0.38, 0.43)
  Top 0.254: R13.2 v50.16,12.7 | v71.25,24.77 U$1.P54
  Route2 0.254: v50.16,12.7 59.69,12.7 59.69,11.05 62.87,11.05 62.87,15.24 67.31,15.24 67.31,21.59 71.37,21.59 80.14,21.59 80.14,25.53 71.25,25.53 v71.25,24.77
ID  (via drill 0.38, 0.43)
  Top 0.254: R12.1 66.93,22.99 63.5,22.99 | 63.5,22.99 IC1.2 | U$1.P50 v76.33,24.77 | v62.1,22.99 63.5,22.99
  Bottom 0.254: v76.33,24.77 76.33,25.53 62.1,25.53 v62.1,22.99
JTAG_TCK  (via drill 0.43)
  Top 0.254: v76.3,3.05 76.33,3.17 U$1.P21
  Route3 0.254: SV2.5 78.23,28.3 78.23,25.53 80.01,25.53 80.01,6.99 76.3,6.99 v76.3,3.05
  Bottom 0.254: R8.2 76.3,5.5 v76.3,3.05
JTAG_TDI  (via drill 0.43)
  Top 0.254: v68.45,9.4 U$1.P12
  Route3 0.254: SV2.3 73.66,28.3 73.66,27.05 69.34,27.05 69.34,9.4 v68.45,9.4
JTAG_TDO  (via drill 0.43)
  Top 0.254: v72.52,3.05 U$1.P18 | v70.1,24.77 70.1,25.91 70.99,25.91 SV2.2
  Route3 0.254: SV2.2 71.12,28.3 | v70.1,24.77 70.1,3.05 v72.52,3.05
JTAG_TMS  (via drill 0.38, 0.43)
  Top 0.254: SV2.4 76.2,28.3 76.2,25.78 79.38,25.78 v79.38,26.29 | v77.5,3.05 77.6,3.1 U$1.P22
  Route3 0.254: v79.38,26.29 80.64,26.29 80.64,6.35 77.5,6.35 v77.5,3.05
LED1  (via drill 0.38, 0.43)
  Top 0.254: R9.2 v60.96,12.06 | U$1.P51 v75.06,24.77
  Route2 0.254: v60.96,12.06 62.23,12.06 62.23,15.88 66.67,15.88 66.67,22.23 75.06,22.23 v75.06,24.77
LED2  (via drill 0.38, 0.43)
  Top 0.254: R10.2 v60.96,14.61 | U$1.P52 v73.79,24.77
  Route2 0.254: v60.96,14.61 61.59,14.61 61.59,16.51 66.04,16.51 66.04,22.86 73.79,22.86 v73.79,24.77
LED3  (via drill 0.38, 0.43)
  Top 0.254: R11.2 v60.96,17.14 | U$1.P53 v72.52,24.77
  Route2 0.254: v60.96,17.14 65.41,17.14 65.41,23.5 72.52,23.5 v72.52,24.77
N$1  (via drill 0.43)
  Top 0.254: v73.79,3.05 U$1.P19
N$2
  Top 0.889: 92.05,8.13 86.11,8.13
N$3
  Top 0.254: 82.04,2.29 87.76,2.29 87.76,0.38 82.04,0.38 82.04,2.29
N$4
  Route2 0.254: 82.04,2.29 87.76,2.29 87.76,0.38 82.04,0.38 82.04,2.29
N$5
  Route3 0.254: 82.04,2.29 87.76,2.29 87.76,0.38 82.04,0.38 82.04,2.29
N$6
  Bottom 0.254: 82.04,2.29 87.76,2.29 87.76,0.38 82.04,0.38 82.04,2.29
N$7
  Bottom 0.406: JP2.1 47.62,25.4 51.41,25.4 JP1.DAT1
N$8
  Top 0.254: C1.2 61.58,1.91 U2.12
N$9
  Top 0.254: U2.8 58.29,4.96 58.29,2.03 C1.1
N$10
  Top 0.254: U2.10 60.58,3.94 60.58,3.56 60.83,3.56 60.83,0.64 64.15,0.64 C2.1
N$11
  Top 0.254: LED1.A 57.57,11.43 R9.1
N$12
  Top 0.254: LED2.A R10.1
N$13
  Top 0.254: U3.10 53.72,8.26 51.44,8.26 51.44,10.03 51.16,10.03 C5.1
N$14
  Top 0.254: LED3.A 57.57,17.78 R11.1
N$15
  Top 0.254: U3.20 53.21,3.08 53.21,1.91 50.8,1.91 50.8,2.54 C6.1
N$17
  Bottom 0.61: U$4.1 40.41,20.32 41.27,20.32 41.27,17.14 C17.1 C18.1 41.01,11.43 34.92,11.43 JP3.2
N$18
  Top 0.406: T1.1 50.16,21.97 50.16,24.13 48.26,24.13 48.26,23.9 | U$2.22_V_BCKP U$2.23_VCC
  Top 0.61: U$2.22_V_BCKP 45.85,23.9 45.97,23.9 48.26,23.9 C13.1
N$19  (via drill 0.43)
  Top 0.254: U$1.P42 v87,22.1
  Top 0.406: 85.6,22.1 U$1.P42
N$20
  Top 0.254: T1.3 46.99,19.94 46.99,16.13 50.16,16.13 R13.1
N$22  (via drill 0.43)
  Top 0.254: v83.95,24.77 U$1.P44
N$23
  Bottom 0.406: U4.2 44.18,3.19 C20.1
NRST  (via drill 0.43)
  Top 0.254: U$1.P35 v87,13.21 88.77,13.21 SV2.9
  Bottom 0.254: v87,13.21 84.19,13.21 R1.1
RX1  (via drill 0.38, 0.43)
  Top 0.254: v68.45,14.48 U$1.P8
  Top 0.305: v46.99,21.64 44.31,21.64 U$2.20_TXD1
  Route3 0.254: v46.99,21.64 66.67,21.64 66.67,14.48 v68.45,14.48
RXD
  Top 0.254: SV2.7 83.7,26.4 80.14,26.4 U$1.P47
SCL  (via drill 0.38, 0.43)
  Top 0.254: v39.37,10.16 39.37,6.99 U1.14 | U2.1 61.59,7.08 61.59,7.75 v62.61,7.75 | v57.02,2.79 57.02,1.14 54.73,1.14 U3.23
  Top 0.406: U$1.P9 68.45,13.2 v68.45,13.34
  Route3 0.254: 62.1,7.75 62.1,8.51 62.87,8.51 62.87,13.21 68.45,13.21 v68.45,13.34 | 62.1,7.75 57.02,7.75 57.02,6.35 | 57.02,6.35 44.45,6.35 44.45,10.92 39.37,10.92 v39.37,10.16 | v62.61,7.75 62.1,7.75 | 57.02,6.35 v57.02,2.79
  Bottom 0.406: v68.45,13.34 68.45,13.21 71.79,13.21 R5.1 | U4.8 53.34,1.94 53.34,2.77 57.02,2.77 v57.02,2.79
SD_CARD_DET  (via drill 0.43)
  Top 0.254: v68.45,10.67 U$1.P11
  Bottom 0.254: JP1.CD2 57.15,14.37 57.15,18.41 66.55,18.41 66.55,14.35 65.91,14.35 65.91,10.67 v68.45,10.67
  Bottom 0.406: R7.1 48.41,14.39 JP1.CD1 JP1.CD2
SD_CLK  (via drill 0.43)
  Top 0.254: U$1.P3 68.96,20.82 v68.45,20.83
  Bottom 0.254: JP1.CLK 54.61,24.67 54.61,19.43 67.56,19.43 67.56,18.8 69.22,18.8 69.22,20.83 v68.45,20.83
SD_CMD  (via drill 0.43)
  Top 0.254: v68.45,19.56 U$1.P4
  Bottom 0.254: JP1.CMD 56.9,24.67 56.9,19.94 68.45,19.94 v68.45,19.56
SD_CS  (via drill 0.38)
  Top 0.254: v58.04,20.7 58.04,18.29 U$1.P5
  Bottom 0.254: JP1.CD/DAT3 58.04,24.27 v58.04,20.7
SD_DATA0  (via drill 0.43)
  Top 0.254: U$1.P6 68.33,17.01 v68.45,17.02
  Bottom 0.254: JP1.DAT0 52.45,24.67 52.45,23.5 53.98,23.5 53.98,18.92 67.06,18.92 67.06,17.02 v68.45,17.02
SDA  (via drill 0.38, 0.43)
  Top 0.254: v40.51,10.16 40.55,10.16 U1.13 | U3.24 55.24,3.08 55.24,1.91 v55.88,1.91 | U2.16 63.25,6.46 v63.25,6.6 | v68.45,11.81 68.45,11.94 U$1.P10
  Route3 0.254: 63.37,6.99 63.37,11.43 67.56,11.43 67.56,11.81 v68.45,11.81 | 63.37,6.99 62.1,6.99 62.1,1.91 56.26,1.91 | 56.26,1.91 56.26,5.71 43.81,5.71 43.81,10.16 v40.51,10.16 | 56.26,1.91 v55.88,1.91 | v63.25,6.6 63.37,6.6 63.37,6.99
  Bottom 0.254: R4.1 71.63,11.68 71.63,11.94 68.45,11.94 v68.45,11.81
  Bottom 0.406: U4.7 50.8,3.19 | 50.8,3.19 50.8,3.17 | 50.8,3.19 50.8,3.81 58.19,3.81 58.19,1.91 v55.88,1.91
SOP0  (via drill 0.43)
  Top 0.254: U$1.P34 v86.97,11.94
  Bottom 0.254: v86.97,11.94 84.2,11.94 84.2,11.4 R6.2
SOP1  (via drill 0.43)
  Top 0.406: U$1.P24 v80.14,3.05
  Bottom 0.406: v80.14,3.05 80.14,5.44 R3.2
SOP2  (via drill 0.43)
  Top 0.406: U$1.P23 v78.87,3.05
  Route3 0.254: SV2.6 81.28,28.3 81.28,5.71 78.87,5.71 v78.87,3.05
  Bottom 0.406: v78.87,3.05 78.87,5.44 R2.2
TIMEPULSE  (via drill 0.38, 0.43)
  Top 0.254: U$2.3_TIMEPULSE 30.73,23.9 v30.73,23.88 | v78.87,24.77 U$1.P48
  Route2 0.254: v30.73,23.88 30.73,28.83 67.31,28.83 67.31,26.67 77.22,26.67 v77.47,26.67 | 78.49,24.77 v78.87,24.77
  Bottom 0.254: v77.47,26.67 77.47,26.04 78.49,26.04 78.49,25.4 78.87,25.4 v78.87,24.77
TX1  (via drill 0.38, 0.43)
  Top 0.254: v68.45,15.75 U$1.P7
  Top 0.305: v46.99,22.86 44.31,22.86 U$2.21_RXD1
  Route3 0.254: v46.99,22.86 48.26,22.86 48.26,22.23 67.31,22.23 67.31,15.75 v68.45,15.75
TXD
  Top 0.254: U$1.P46 81.68,23.37 81.68,25.91 86.23,25.91 SV2.8
VDD  (via drill 0.38, 0.43)
  Top 0.254: U$1.P40 v87,19.56 | U$1.P37 v87,15.75 87,14.48 U$1.P36 | C7.1 49.53,7.62 50.8,7.62 50.8,6.33 U3.13 51.44,6.33 v51.44,7.11 | v55.24,8.38 54.73,8.38 U3.8 | U2.13 64.01,4.96 64.01,5.59 | 64.01,6.1 65.28,6.1 C3.1 | 61.09,8.64 60.08,8.64 U2.4 | U2.2 61.09,8.64 | 61.09,8.64 64.01,8.64 64.01,6.1 | 64.01,6.1 64.01,5.59 | 64.01,5.59 v63.25,5.59 | U1.1 40.64,5.88 40.64,4.19 | 40.64,4.19 40.64,3.17 C4.1 | 44.65,5.88 U1.7 | 40.64,4.19 v39.5,4.19 | 44.65,5.88 46.35,5.88 | 46.35,5.88 C14.1 | U1.6 44.65,5.88 | 46.35,5.88 v46.35,7.24 | v55.88,23.11 C8.1 C9.1 | R12.2 66.04,25.61 v66.04,26.67
  Top 0.406: T1.2 50.8,19.94 50.8,17.78 v48.26,17.78
  Bottom 0.254: R1.2 82.68,13.51 82.68,15.75 84.45,15.75 | 84.45,15.75 v87,15.75 | 73.49,12.57 67.69,12.57 67.69,12.32 v66.8,12.32 | 84.45,15.75 84.45,17.14 C11.1 C12.1 84.33,19.05 84.33,19.43 84.2,19.43 84.2,19.56 | 84.2,19.56 v87,19.56 | C10.1 84.2,19.56 | v51.44,7.11 55.24,7.11 v55.24,8.38 | JP1.VCC 55.88,24.87 v55.88,23.11 | R4.2 73.53,11.68 73.53,12.57 73.49,12.57 | 73.49,12.57 R5.2
  Bottom 0.406: R5.2 73.53,13.72 | R7.2 v48.26,17.78 | U4.5 49.53,5.68 C7.1 46.35,7.35 v46.35,7.24 | U4.4 46.35,5.68 v46.35,7.24 | U4.1 39.5,1.94 v39.5,4.19 | C19.1 46.35,6.99 v46.35,7.24
  Bottom 0.61: C15.1 C16.1 34.92,17.14 34.92,20.32 35.79,20.32 U$4.3 36.2,20.4 36.2,24.13 41.27,24.13 v41.27,27.94 v42.55,27.94 v43.81,27.94 v45.09,27.94
  pour Route2 (isolate 0.305): 29.72,29.69 92.33,29.69 92.33,12.45 84.58,12.45 84.58,4.57 92.2,4.57 92.2,0.25 29.72,0.25
(copper drawn outside any net)
  shapes: Top area x17, Top circle x1

### Text on the board
Top: 1
Route2: 2
Route3: 3
Bottom: 4
tPlace: IoT sight | Rev:A | Rafi Taub | taubrafi@gmail.com | Nick Kuhlik | nick.kuhlik@gmail.com | Technion-EE-HSDSL | Vin | Spring-2016 | GND | Sup:Mony Orbach
bPlace: Debug: | GND | SOP2 | RX< | TX> | nRST | 3v3 | TDO | TDI | TMS | TCK